# EasyEDA Pro project ULPLoRa.eprj

# Board ULPLoRa
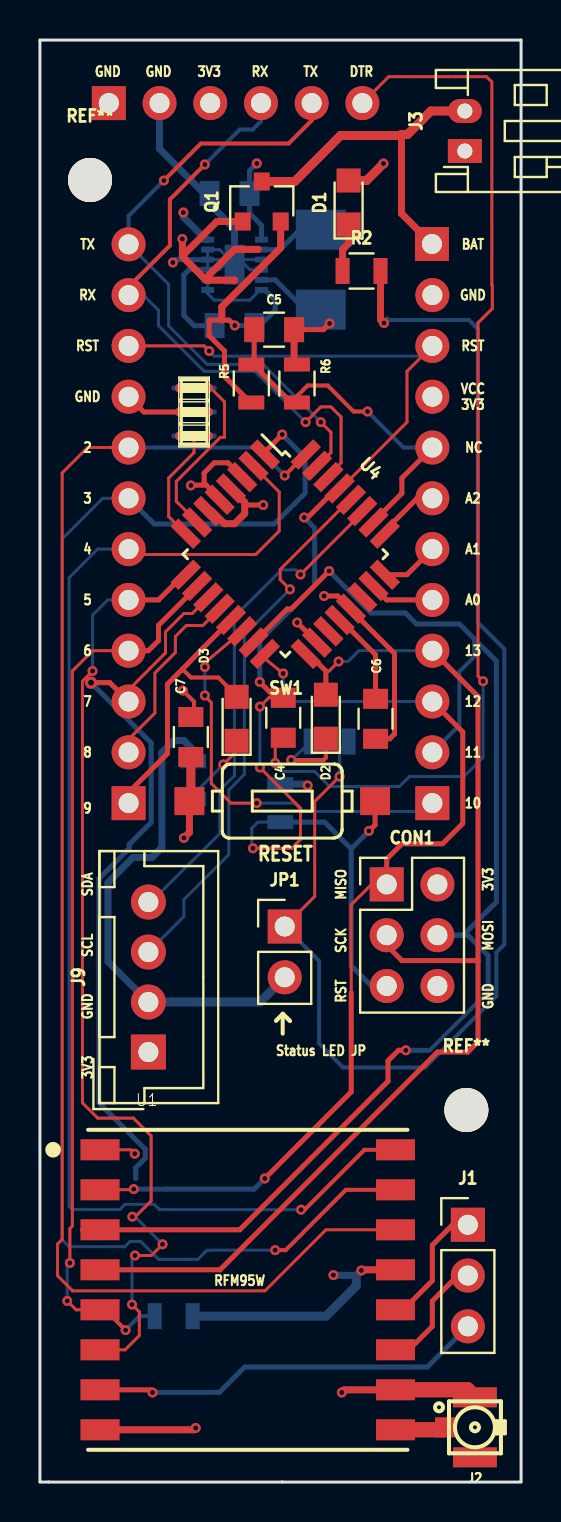
[diagram p0: board, top side]
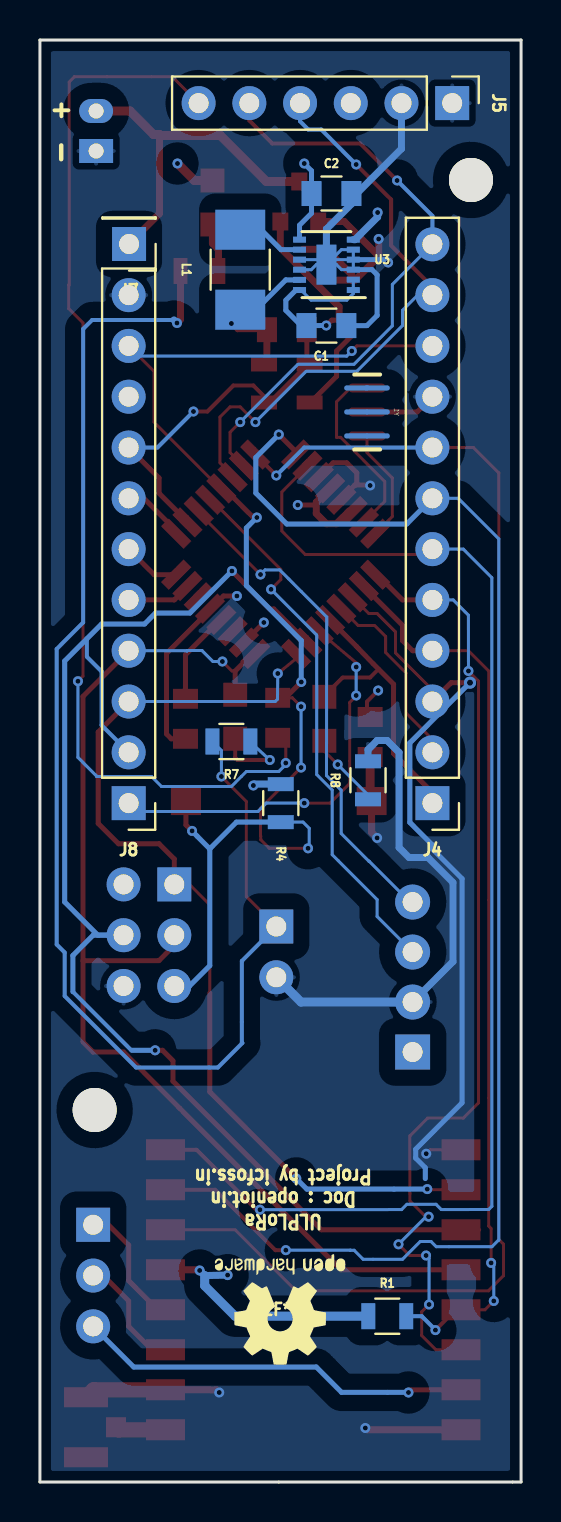
[diagram p1: board, bottom side, seen from below]

Outline 24.1 x 72.1 mm; copper layers: Top Layer, ground.plane, power.plane, Bottom Layer. Coordinates in mm from the lower left corner of the outline.
Outline path: 0,72.1 0,0 24.1,0 24.1,72.1 0,72.1
Stack: Top Layer 0.035mm / Dielectric1 0.48mm PP er 4.5 / ground.plane 0.035mm / Dielectric2 0.48mm FR4 er 4.5 / power.plane 0.035mm / Dielectric3 0.48mm PP er 4.5 / Bottom Layer 0.035mm

## Design rules (mm)
spacing safeClearance (default): track to track 0.152, other pairs 0.152 to 0.3
track width trackWidth (default): min 0.127, default 0.254, max 2.54
differential pair differentialPair (default): width min 0.127, default 0.254, max 2.54; gap min 0.152, default 0.152
via viaSize (default): diameter min 0.5, default 0.61, max 10; hole min 0.3, default 0.305, max 6
net GND uses CopperRegion2
net +3V3 uses CopperRegion1
pour ie1253 uses CopperRegion1
pour ie1254 uses CopperRegion
pour ie1255 uses CopperRegion2

## Placement (name value [footprint] x y rotation side)
C1  10uF  [Capacitors_SMD:C_0805]  9.75 57.82 180 bottom
C2  22uF  [Capacitors_SMD:C_0805]  9.5 64.42 180 bottom
C4  0.1uF  [Capacitors_SMD:C_0805]  12.19 38.21 270 top
C5  100nF  [Capacitors_SMD:C_0805]  11.73 57.62 0 top
C6  0.1uf  [Capacitors_SMD:C_0805]  16.81 38.16 270 top
C7  0.1uF  [Capacitors_SMD:C_0805]  7.56 37.25 270 top
CON1  AVR-ISP-6  [Pin_Headers:Pin_Header_Straight_2x03_Pitch2.54mm]  17.37 29.88 0 top
D1  RED  [LEDs:LED_0805]  15.46 63.97 90 top
D2  Green  [LEDs:LED_0805]  14.32 38.26 90 top
D3  Blue  [LEDs:LED_0805]  9.85 38.16 90 top
J1  DIO_BRK  [Pin_Headers:Pin_Header_Straight_1x03_Pitch2.54mm]  21.43 12.86 0 top
J2  Conn_Coaxial  [Footprints:U.FL-COAX]  21.79 2.73 0 top
J3  JST  [Connectors_JST:JST_PH_S2B-PH-K_02x2.00mm_Angled]  21.28 66.55 90 top
J4  LH_Connector  [Pin_Headers:Pin_Header_Straight_1x12_Pitch2.54mm]  4.44 33.94 0 bottom
J5  UART  [Pin_Headers:Pin_Header_Straight_1x06_Pitch2.54mm]  3.45 68.94 270 bottom
J7  VIN  [Pin_Headers:Pin_Header_Straight_1x01_Pitch2.54mm]  19.63 61.9 0 bottom
J8  RH_Connector  [Pin_Headers:Pin_Header_Straight_1x11_Pitch2.54mm]  19.66 33.94 0 bottom
J9  I2C  [Connectors_JST:JST_XH_B04B-XH-A_04x2.50mm_Straight]  5.43 21.5 90 top
JP1  JP  [Pin_Headers:Pin_Header_Straight_1x02_Pitch2.54mm]  12.26 27.77 0 top
L1  2.2uH  [Inductors_SMD:L_1210_HandSoldering]  14.07 60.61 90 bottom
Q1  DMG3415U-7  [TO_SOT_Packages_SMD:SOT-23]  11.11 64.02 90 top
R1  10K  [Resistors_SMD:R_0805]  6.7 8.29 180 bottom
R2  330  [Resistors_SMD:R_0805]  16.11 60.55 0 top
R4  10K  [Resistors_SMD:R_0805]  12.04 33.94 270 bottom
R5  680K  [Resistors_SMD:R_0805]  10.59 54.92 90 top
R6  680K  [Resistors_SMD:R_0805]  12.87 54.92 90 top
R7  330  [Resistors_SMD:R_0805]  14.51 37.02 0 bottom
R8  330  [Resistors_SMD:R_0805]  7.67 35.09 90 bottom
REF**  -  [Mounting_Holes:MountingHole_2.2mm_M2]  2.51 65.1 0 top
REF**#2  -  [Mounting_Holes:MountingHole_2.2mm_M2]  21.36 18.6 0 top
REF***  OSHW-Logo2_7.3x6mm_SilkScreen  [Symbols:OSHW-Logo2_7.3x6mm_SilkScreen]  12.07 8.62 0 bottom
SW1  RESET  [Footprints:3x6x2.5mm_tact_switch]  12.14 34.05 180 top
U1  RFM95W-868S2  [Footprints:XCVR_RFM95W-868S2]  10.41 9.61 0 top
U3  RP604K331A  [Footprints:DFN-12-1EP_2.7x3mm_Pitch0.5mm]  9.75 60.87 0 bottom
U4  ATMEGA328P-AU  [Housings_QFP:TQFP-32_7x7mm_Pitch0.8mm]  12.29 46.39 315 top
Y1  8Mhz  [Footprints:RESONATOR-SMD]  7.72 53.5 90 top

## Footprints (pads in the part's own frame, mm; a bottom-side part is the same pattern mirrored in y, then rotated)
Capacitors_SMD:C_0805
  rect 1x1.25 smd: 1(-1,0) 2(1,0)
Connectors_JST:JST_PH_S2B-PH-K_02x2.00mm_Angled
  rect 1.2x1.7 hole 0.75: 1(0,0)
  oval 1.2x1.7 hole 0.75: 2(2,0)
Connectors_JST:JST_XH_B04B-XH-A_04x2.50mm_Straight
  rect 1.75x1.75 hole 1: 1(0,0)
  round 1.75 hole 1: 2(2.5,0) 3(5,0) 4(7.5,0)
Footprints:3x6x2.5mm_tact_switch
  rect 1.5x1.4 smd: 1(-4.65,0) 2(4.65,0)
Footprints:DFN-12-1EP_2.7x3mm_Pitch0.5mm
  rect 0.65x0.3 smd: 1(-1.346,1.27) 2(-1.347,0.75) 3(-1.347,0.25) 4(-1.347,-0.25) 5(-1.347,-0.75) 6(-1.347,-1.25) 7(1.347,-1.25) 8(1.347,-0.75) 9(1.347,-0.25) 10(1.346,0.254) 11(1.346,0.762) 12(1.346,1.27)
  rect 1x2 smd: 13(0,0)
Footprints:RESONATOR-SMD
  oval 0.45x1.905 smd: 1(-1.199,0) 2(0,0) 3(1.199,0)
Footprints:U.FL-COAX
  rect 1x1 smd: 1(-1.5,0)
  rect 2.2x1 smd: 2(0,1.5) 3(0,-1.5)
Footprints:XCVR_RFM95W-868S2
  rect 1.95x1.05 smd: 1(-7.4,7) 2(-7.4,5) 3(-7.4,3) 4(-7.4,1) 5(-7.4,-1) 6(-7.4,-3) 7(-7.4,-5) 8(-7.4,-7) 9(7.4,-7) 10(7.4,-5) 11(7.4,-3) 12(7.4,-1) 13(7.4,1) 14(7.4,3) 15(7.4,5) 16(7.4,7)
Housings_QFP:TQFP-32_7x7mm_Pitch0.8mm
  rect 1.6x0.55 smd: 1(-4.25,2.8) 2(-4.25,2) 3(-4.25,1.2) 4(-4.25,0.4) 5(-4.25,-0.4) 6(-4.25,-1.2) 7(-4.25,-2) 8(-4.25,-2.8) 17(4.25,-2.8) 18(4.25,-2) 19(4.25,-1.2) 20(4.25,-0.4) 21(4.25,0.4) 22(4.25,1.2) 23(4.25,2) 24(4.25,2.8)
  rect 0.55x1.6 smd: 9(-2.8,-4.25) 10(-2,-4.25) 11(-1.2,-4.25) 12(-0.4,-4.25) 13(0.4,-4.25) 14(1.2,-4.25) 15(2,-4.25) 16(2.8,-4.25) 25(2.8,4.25) 26(2,4.25) 27(1.2,4.25) 28(0.4,4.25) 29(-0.4,4.25) 30(-1.2,4.25) 31(-2,4.25) 32(-2.8,4.25)
Inductors_SMD:L_1210_HandSoldering
  rect 2x2.5 smd: 1(-2,0) 2(2,0)
LEDs:LED_0805
  rect 1.2x1.2 smd: 1(-1.1,0) 2(1.1,0)
Mounting_Holes:MountingHole_2.2mm_M2
  round 2.2 hole 2.2: (0,0)
Pin_Headers:Pin_Header_Straight_1x01_Pitch2.54mm
  rect 1.7x1.7 hole 1: 1(0,0)
Pin_Headers:Pin_Header_Straight_1x02_Pitch2.54mm
  rect 1.7x1.7 hole 1: 1(0,0)
  round 1.7 hole 1: 2(0,-2.54)
Pin_Headers:Pin_Header_Straight_1x03_Pitch2.54mm
  rect 1.7x1.7 hole 1: 1(0,0)
  round 1.7 hole 1: 2(0,-2.54) 3(0,-5.08)
Pin_Headers:Pin_Header_Straight_1x06_Pitch2.54mm
  rect 1.7x1.7 hole 1: 1(0,0)
  round 1.7 hole 1: 2(0,-2.54) 3(0,-5.08) 4(0,-7.62) 5(0,-10.16) 6(0,-12.7)
Pin_Headers:Pin_Header_Straight_1x11_Pitch2.54mm
  rect 1.7x1.7 hole 1: 1(0,0)
  round 1.7 hole 1: 2(0,-2.54) 3(0,-5.08) 4(0,-7.62) 5(0,-10.16) 6(0,-12.7) 7(0,-15.24) 8(0,-17.78) 9(0,-20.32) 10(0,-22.86) 11(0,-25.4)
Pin_Headers:Pin_Header_Straight_1x12_Pitch2.54mm
  rect 1.7x1.7 hole 1: 1(0,0)
  round 1.7 hole 1: 2(0,-2.54) 3(0,-5.08) 4(0,-7.62) 5(0,-10.16) 6(0,-12.7) 7(0,-15.24) 8(0,-17.78) 9(0,-20.32) 10(0,-22.86) 11(0,-25.4) 12(0,-27.94)
Pin_Headers:Pin_Header_Straight_2x03_Pitch2.54mm
  rect 1.7x1.7 hole 1: 1(0,0)
  round 1.7 hole 1: 2(2.54,0) 3(0,-2.54) 4(2.54,-2.54) 5(0,-5.08) 6(2.54,-5.08)
Resistors_SMD:R_0805
  rect 0.7x1.3 smd: 1(-0.95,0) 2(0.95,0)
TO_SOT_Packages_SMD:SOT-23
  rect 0.9x0.8 smd: 1(-1,0.95) 2(-1,-0.95) 3(1,0)

## Nets
+3V3: C2.1 C7.1 CON1.2 D1.2 J5.3 J8.9 J9.1 R1.1 R4.1 U1.13 U3.6 U3.7 U4.4 U4.6 U4.18
/VIN: J3.2 J7.1 Q1.3
GND: C1.2 C2.2 C5.2 C6.2 C7.2 CON1.6 J2.2 J3.1 J4.9 J5.1 J5.2 J8.11 J9.2 JP1.2 Q1.1 R6.2 R8.2 SW1.2 U1.1 U1.8 U1.10 U3.3 U3.4 U3.5 U3.9 U3.10 U3.13 U4.3 U4.5 U4.21 Y1.2
/2: J4.8 U1.14 U4.32
/3: J4.7 U1.15 U4.1
/4: J4.6 U1.16 U4.2
/5: J4.5 U1.6 U4.9
/6: J4.4 R1.2 U1.5 U4.10
/7: J4.3 U4.11
/8: J4.2 U4.12
/9: D3.2 J4.1 U4.13
/10: J8.1 U4.14
/11: CON1.4 J8.2 U1.3 U4.15
/12: CON1.1 J8.3 U1.2 U4.16
/13: CON1.3 D2.2 J8.4 U1.4 U4.17
/A0: J8.5 U4.23
/A1: J8.6 U4.24
/A2: J8.7 U4.25
/A3: C5.1 J8.8 R5.2 R6.1 U4.26
/A4: J9.4 U4.27
/A5: J9.3 U4.28
/A6: U4.19
/A7: U4.22
/DTR: C4.2 J5.6
/RAW: C1.1 Q1.2 R5.1 U3.1 U3.2 U3.12
/RST: C4.1 CON1.5 J4.10 J8.10 R4.2 SW1.1 U4.29
/RXD: J4.11 J5.4 U4.30
/TXD: J4.12 J5.5 U4.31
NET-(C6-PAD1): C6.1 U4.20
NET-(D1-PAD1): D1.1 R2.1
NET-(D2-PAD1): D2.1 R7.1
NET-(D3-PAD1): D3.1 R8.1
NET-(J1-PAD1): J1.1 U1.12
NET-(J1-PAD2): J1.2 U1.11
NET-(J1-PAD3): J1.3 U1.7
NET-(J2-PAD1): J2.1 U1.9
NET-(JP1-PAD1): JP1.1 R2.2 R7.2
NET-(L1-PAD1): L1.1 U3.11
NET-(L1-PAD2): L1.2 U3.8
NET-(U4-PAD7): U4.7 Y1.3
NET-(U4-PAD8): U4.8 Y1.1

Pads without a net: J2 3

## Via types
v1: diameter 0.5, hole 0.25, Top Layer to Bottom Layer, 61 vias
v2: diameter 0.61, hole 0.305, Top Layer to Bottom Layer, 1 via

## Routing (per net, layer and track width the routed paths; a pad name or vN(x,y) marks a point on that pad's centre or on a via; arc(x,y) is an arc through that point)
+3V3: length 152.4
  Top Layer w0.15: 13.88,41.97 13.88,42.25
  Top Layer w0.2: 7.72,38.25 7.72,39.02 v1(7.16,39.57)
  Top Layer w0.25: U4.4 9.57,49.62 10.34,48.85 v1(11.19,48.85) ; v1(12.88,42.97) 13.88,41.98 13.88,41.97 13.88,42
  Top Layer w0.35: U4.4 10.26,48.99 10.26,48.42 9.75,47.91 9.24,47.91 8.61,48.55 U4.6 ; U1.13 16.13,10.61 v1(16.1,10.58)
  Top Layer w0.45: D1.2 16.36,65.07 v1(17.21,65.92)
  power.plane w0.2: 6.93,43.13 7.21,42.85 7.21,39.62 v1(7.16,39.57)
  power.plane w0.25: v1(11.19,48.85) 11.71,48.32 11.71,47.91 ; 12.26,41.31 12.26,42.35 v1(12.88,42.97)
  power.plane w0.35: v1(13.41,34.82) 14,34.24 14,33.84 ; 12,9.07 12,9.02 11.96,9.07 11.05,9.07 ; 18.13,54.26 J8.9 ; v1(7.19,63.47) 7.76,64.05 10.86,64.05 ; 9.89,15.76 5.43,20.22 J9.1 ; 8.53,68.94 8.53,68.65
  power.plane w0.45: J8.9 15.1,54.26 10.86,58.5 v1(10.86,65.92) 10.23,66.55 ; 17.36,33.19 16.53,34.02 14.19,34.02 12.58,32.42 12.54,32.42 9.24,29.12 9.24,25.31 J9.1 ; 17.36,33.19 17.36,36.92 12.97,41.31 11.81,41.31 ; 17.36,33.19 18.64,31.91 18.64,31.15 CON1.2 ; 11.81,41.31 12.26,41.31 ; 11.81,41.31 8.75,41.31 6.93,43.13 6.93,45.6 10.77,47.91 11.78,47.91 18.13,54.26 ; v1(17.21,65.92) 16.58,66.55 10.23,66.55 ; 10.23,66.55 8.53,68.25 8.53,68.94 ; v1(14.7,10.34) 14.44,10.34 13.93,9.83 13.93,9.82 13.17,9.07 11.05,9.07 9.89,10.23 9.89,15.76
  Bottom Layer w0.25: U3.7 11.1,62.84 10.5,63.44 C2.1 10.5,65.56 v1(10.86,65.92)
  Bottom Layer w0.35: R4.1 13.34,34.89 v1(13.41,34.82) ; v1(16.1,10.58) 15.85,10.32 v1(14.7,10.34) ; U3.6 8.32,62.12 7.19,63.25 v1(7.19,63.47)
  Bottom Layer w0.45: R1.1 14.32,8.29 15.85,9.81 15.85,10.32
/VIN: length 17.7
  Top Layer w0.35: 18.11,67.37 18.11,63.42 J7.1
  Top Layer w0.45: J3.2 19.58,68.55 18.41,67.37 18.11,67.37 18.06,67.32 15.06,67.32 12.76,65.02 Q1.3
GND: length 250.2
  Top Layer w0.15: v1(4.75,16.41) 4.55,16.61 U1.1
  Top Layer w0.25: 8.33,49.84 9,49.17 U4.5 ; 8.33,49.84 8.23,49.95 8.23,50.45 8.73,50.96 9.41,50.96 U4.3 ; 8.33,49.84 7.58,49.84 v1(7.56,49.82) ; Y1.2 5.2,53.5 J4.9 ; C5.2 14.2,57.62 v1(14.51,57.92) ; v1(14.23,44.3) 14.91,44.3 15.54,43.67 U4.21 15.58,43.61 17.76,41.42 17.76,37.4 17.52,37.16 C6.2 ; 7.72,34.28 SW1.2
  Top Layer w0.35: 9.75,60.11 9.73,60.09 8.48,60.09 ; v1(7.21,32.2) 7.49,32.48 SW1.2 ; U1.8 7.71,2.61 v1(7.8,2.7) ; U4.21 15.58,43.61 ; 8.48,60.09 8.32,60.09 7.13,61.27 7.13,61.3 ; 8.48,60.09 8.48,60.36 9.75,61.63 10.94,61.63 ; v1(15.12,4.47) 15.25,4.61 U1.10 16.99,4.61 ; Q1.1 8.86,63.02 7.13,61.3 ; 7.13,61.3 v1(7.13,62.15) ; R6.2 12.73,56.02 C5.2
  Top Layer w0.45: C7.2 7.56,34.12 SW1.2
  Top Layer w0.762: J2.2 21.41,4.61 U1.10
  ground.plane w0.25: v1(7.56,49.82) 6.11,48.37 6.11,48.25 ; v1(6.66,60.97) 6.7,60.93 ; v1(14.51,57.92) 14.66,58.07 ; 15.64,46.08 15.64,45.71 v1(14.23,44.3) ; 5.99,67.78 5.43,67.22 ; 7.46,24.04 7.42,24 J9.2
  ground.plane w0.35: v1(7.21,32.2) 6.96,32.2 6.96,29.63 7.46,29.12 7.46,23.53 7.42,23.53 7.42,23.82 ; v1(4.75,16.41) 5.43,16.42 ; 15.08,22.77 19.91,22.77 CON1.6 ; 15.08,22.77 8.48,22.77 7.42,23.82 ; 15.08,22.77 15.08,33.96 16.35,35.23 16.35,40.79 16.86,41.3 ; 15.11,4.48 v1(15.12,4.47) ; 7.42,24 7.42,23.82 ; v1(7.13,62.15) 6.66,61.67 v1(6.66,60.97) ; 12.15,4.1 12.15,4.09 ; 5.43,15.15 5.43,15.4 5.43,15.08
  ground.plane w0.45: 11.3,3.25 12.15,4.1 ; 11.3,3.25 11.3,9.21 5.43,15.08 ; 11.3,3.25 8.35,3.25 v1(7.8,2.7) ; 6.7,60.93 6.7,57.97 ; 6.7,57.97 6.7,56.52 J4.9 4.44,53.94 6.11,52.27 6.11,48.25 7.46,46.89 10.26,46.9 14.83,46.9 16.86,44.87 16.86,41.3 ; 6.7,57.97 6.7,58.33 8.48,60.11 12.29,60.11 13.05,59.34 14.66,59.34 ; 14.66,58.07 14.66,59.34 ; 14.66,59.34 J8.11 21.53,59.34 22.61,60.42 22.61,65.22 J3.1 ; 15.11,4.48 12.54,4.48 12.15,4.09 ; J5.2 5.99,67.78 5.18,66.96 4.16,66.96 3.45,67.67 J5.1 ; 5.43,16.42 5.43,15.15 ; 5.43,15.4 7.42,17.39 7.42,23.53
  Bottom Layer w0.15: U3.13 9.24,60.87 8.99,60.62 U3.3 U3.4 ; U3.13 9.5,61.12 U3.4 ; U3.13 10.26,60.87 10.51,60.61 U3.10 ; U3.13 9,61.62 U3.5 U3.4 ; U3.13 10,61.12 U3.9
  Bottom Layer w0.25: U3.3 7.47,60.62 7.21,60.36 7.21,58.33 7.72,57.82 C1.2 ; v1(6.66,60.97) 6.8,61.12 U3.4 ; C2.2 8.73,64.42
  Bottom Layer w0.35: J9.2 3.41,26.02 3.41,29.97 4.66,31.22 5.61,31.22 6.11,31.72 6.11,36.47 6.71,37.07 7.21,37.07 7.67,36.62 R8.2 ; U3.13 9.75,62.65 8.5,63.9 C2.2 8.23,64.42 5.99,66.66 J5.2
  Bottom Layer w0.45: JP1.2 11.02,24 J9.2
/2: length 72.6
  Top Layer w0.15: U1.14 14.32,12.61 11.27,9.56 1.62,9.56 1.62,9.57 0.88,10.31 0.88,11.89 1.11,12.13 1.11,50.45 2.38,51.72 J4.8 ; 13.21,51.37 U4.32
  Top Layer w0.2: U4.32 13.31,51.37 v1(12.26,50.32)
  Bottom Layer w0.2: J4.8 10.86,51.72 v1(12.26,50.32)
/3: length 73.3
  Top Layer w0.2: v1(11.78,11.59) 12.31,11.59 15.33,14.61 U1.15
  Top Layer w0.25: U4.1 11.26,51.5 v1(12.13,52.37)
  Bottom Layer w0.15: J4.7 3.15,49.18 1.11,47.15 1.11,12.1 1.12,12.1 1.46,11.76 4.25,11.76 4.51,12.02 5.05,12.02 5.94,11.13 7.91,11.13 8.36,11.58 8.55,11.58 8.55,11.59 v1(11.78,11.59)
  Bottom Layer w0.2: 4.83,49.5 J4.7
  Bottom Layer w0.25: v1(12.13,52.37) 13.28,51.22 13.28,49.45 11.73,47.9 5.73,47.9 J4.7
/4: length 64.8
  Top Layer w0.15: 10.7,50.81 10.7,50.79 11.98,49.5 11.98,47.55 10.81,46.37 4.71,46.37 J4.6
  Top Layer w0.2: U1.16 16.26,16.61 13.26,13.61 v1(13.08,13.61)
  Top Layer w0.25: 10.7,50.77 10.7,50.81
  Bottom Layer w0.15: v1(13.08,13.61) 5.98,13.62 5.72,13.88 4.26,13.88 4,13.62 3.83,13.62 1.62,13.62 1.46,13.78 1.46,45.22 2.89,46.64 J4.6
/5: length 49.4
  Top Layer w0.15: v1(4.63,13.26) 4.78,13.26 5.57,14.05 5.57,17.3 4.68,18.2 2.89,18.2 2.13,18.96 2.13,40.04 v1(2.63,40.55) ; v1(4.76,11.32) 5.58,11.32 v1(6.14,11.88) ; U1.6 4.27,6.61 4.98,7.32 4.98,8.5 v1(4.61,8.88)
  Top Layer w0.25: J4.5 5.94,44.1 7.2,45.36 7.3,45.36
  Bottom Layer w0.15: 3.91,44.1 J4.5 3.4,44.1 2.64,43.34 2.64,41.05 v1(2.63,40.55) ; v1(6.14,11.88) 4.76,13.26 v1(4.63,13.26) ; v1(4.61,8.88) 4.61,11.17 v1(4.76,11.32)
/6: length 45.4
  Top Layer w0.15: J4.4 2.64,41.56 1.62,40.55 1.62,12.8 1.5,12.67 v1(1.5,10.95) ; 3.08,8.61 U1.5 1.81,8.61 v1(1.37,9.05)
  Top Layer w0.2: v1(4.29,7.59) 3.27,8.61 U1.5
  Top Layer w0.25: J4.4 5.43,41.56 5.94,42.07 5.94,42.83 7.87,44.76 U4.10
  Bottom Layer w0.15: v1(1.37,9.05) 1.37,10.82 v1(1.5,10.95)
  Bottom Layer w0.2: R1.2 4.97,8.29 4.29,7.6 v1(4.29,7.59)
/7: length 37.8
  Top Layer w0.15: U4.11 7.63,43.42 7.21,43.42 6.29,42.5 6.29,41.45 4.44,39.61 J4.3
  Top Layer w0.25: U4.11 8.36,44.23
  Top Layer w0.254: v2(2.56,39.97) 3.5,39.97 J4.3
  Bottom Layer w0.254: 4.8,15.17 4.8,15.71 5.28,16.2 5.28,16.63 2.96,18.96 2.96,30.16 4.47,31.68 4.47,31.88 5.57,32.98 5.57,36.95 v2(2.56,39.97)
/8: length 9.6
  Top Layer w0.15: J4.2 4.44,37.13 5.76,38.45 5.76,40.45 6.78,41.47 6.78,42.27 7.33,42.82 8.16,42.82 U4.12
  Top Layer w0.25: U4.12 9,43.61
/9: length 14.6
  Top Layer w0.2: 7.14,40.64 7.56,40.22 8.94,40.22 9.85,39.31 D3.2
  Top Layer w0.25: U4.13 8.23,41.76 7.4,40.91 6.38,39.89 6.39,39.22 6.39,36.43 4.44,34.48 J4.1
/10: length 21.3
  Top Layer w0.15: v1(10.86,33.94) 9.57,33.94 8.58,34.92 8.58,38.97 8.26,39.3 v1(8.26,39.32) ; 10.06,42.54 U4.14 8.26,40.96 ; 8.26,40.96 v1(8.26,40.75) 8.26,40.96
  Top Layer w0.25: U4.14 10.21,42.54
  Bottom Layer w0.15: v1(10.86,33.94) 12.76,33.94 13.18,33.52 19.24,33.52 J8.1 19.15,33.94 ; 8.26,40.75 v1(8.26,39.32)
/11: length 69.4
  Top Layer w0.15: 10.66,41.97 10.7,41.97 10.7,42.26
  Top Layer w0.25: v1(18.33,21.58) 17.96,21.58 17.44,21.06 17.44,20.04 10.01,12.61 U1.3 2.13,12.61 ; 10.7,41.97 10.71,41.97 12.38,43.65 12.58,43.65 v1(14.48,45.55)
  Bottom Layer w0.15: 20.67,27.34 CON1.4
  Bottom Layer w0.2: 19.48,21.58 19.52,21.58 22.45,24.51 ; J8.2 21.01,37.84 21.01,40.52 21.75,41.26 21.75,42.16
  Bottom Layer w0.25: v1(18.33,21.58) 19.48,21.58 ; v1(14.48,45.55) 16.58,43.45 18.31,43.45 18.86,42.9 21.01,42.9 22.86,41.05 22.86,29 21.2,27.34 CON1.4 21.43,27.34 22.45,26.32 22.45,24.51
/12: length 48.9
  Top Layer w0.15: v1(12.19,40.42) 11.26,41.17 U4.16 ; 15.59,24.45 15.59,28.86 16.61,29.88 CON1.1 ; U1.2 4.67,14.62 v1(4.7,14.64)
  Top Layer w0.25: J8.3 21.18,37.5 21.18,32.93 20.16,31.91 18.13,31.91 17.37,31.15 CON1.1 ; 15.59,24.45 15.59,19.51 v1(11.26,15.17)
  Bottom Layer w0.15: v1(12.19,40.42) 12.2,39.14 12.32,39.02 J8.3
  Bottom Layer w0.25: v1(4.7,14.64) 6.36,14.64 10.73,14.64 v1(11.26,15.17)
/13: length 58.3
  Top Layer w0.15: 14.32,40.55 14.48,40.55 v1(14.96,41.02)
  Top Layer w0.25: 21.94,26.07 21.94,39.28 J8.4 ; 21.94,26.07 18.13,26.07 17.37,26.83 CON1.3 ; 21.94,26.07 21.94,22.01 21.43,21.5 19.91,21.5 9.02,10.61 U1.4 ; 13.21,41.4 U4.17 13.46,41.4 14.32,40.55 D2.2
  Bottom Layer w0.15: v1(14.96,41.02) 15.44,41.02 15.98,41.57 16.71,41.57 16.73,41.55 16.73,41.56 19.93,41.56
/A0: length 3.3
  Top Layer w0.25: U4.23 16.71,44.76 17.37,44.1 J8.5
/A1: length 2.9
  Top Layer w0.25: J8.6 18.38,45.36 17.27,45.36
/A2: length 3.3
  Top Layer w0.15: 17.27,47.42 17.38,47.42
  Top Layer w0.25: 17.27,47.42 17.27,47.56 18.89,49.18 J8.7
/A3: length 18.7
  Top Layer w0.15: U4.26 16.71,48.27
  Top Layer w0.2: R6.1 12.87,54.29 13.41,54.82 14.41,54.82 15.71,53.52 v1(16.41,53.52)
  Top Layer w0.25: R6.1 12.58,53.97 10.68,55.87 R5.2 10.73,56.02 C5.1 ; U4.26 16.71,48.02 18.13,49.44 18.13,50.2 J8.8
  Bottom Layer w0.2: J8.8 18.21,51.72 v1(16.41,53.52)
/A4: length 25.3
  Top Layer w0.15: 15.97,48.55 U4.27 ; 16.14,48.47 v1(13.05,45.37)
  Top Layer w0.25: U4.27 16.14,48.47
  Bottom Layer w0.15: v1(13.05,45.37) 12.82,45.6 12.09,45.6 9.73,43.25 9.75,35.32 9.01,34.59 9.01,32.42 7.61,31.02 7.61,31.04 5.57,29 J9.4
  Bottom Layer w0.25: 5.57,29 J9.4
/A5: length 27.4
  Top Layer w0.15: v1(12.52,44.63) 12.04,45.12 12.04,45.63 15.52,49.11
  Top Layer w0.25: U4.28 15.52,49.11
  Bottom Layer w0.15: v1(12.52,44.63) 10.24,42.35 10.24,35.37 9.46,34.6 9.46,31.37 7.21,29.12 7.21,28.28 J9.3
  Bottom Layer w0.25: J9.3 5.61,26.5
/DTR: length 54.3
  Top Layer w0.15: C4.2 11.78,36.81 v1(11.78,35.95) ; J5.6 17.47,70.27 22.37,70.27 22.63,70 22.63,59.85 22.66,59.85 22.66,58.67 21.94,57.96 21.94,40.29 v1(22.2,40.04)
  Bottom Layer w0.15: v1(11.78,35.95) 11.78,35.87 12.13,35.52 13.76,35.52 14.51,34.77 18.01,34.77 18.51,35.27 21.26,35.27 21.26,35.29 22.2,36.23 v1(22.2,40.04)
/RAW: length 20
  Top Layer w0.25: R5.1 10.55,53.97 9.24,55.28 9.24,56.55 8.48,57.31 8.48,58.09 9.48,58.09 v1(9.76,57.82)
  Top Layer w0.35: 9.11,58.09 9.11,58.76 12.06,61.71 Q1.2
  Bottom Layer w0.15: 8.4,60.12 U3.1 8.4,59.42 8.73,59.09 10.51,59.09 11.02,59.6 U3.12
  Bottom Layer w0.25: U3.12 11.27,59.6 11.78,59.09 11.78,58.58 11.02,57.82 C1.1 v1(9.76,57.82)
/RST: length 67.5
  Top Layer w0.15: J4.10 8.23,56.8 v1(8.48,56.55) ; v1(10.67,31.68) 12.61,31.68 13.04,32.11 13.04,32.29 13.05,32.29 13.05,33.69 v1(11.02,35.72) ; v1(11.02,38.77) 11.46,39.21 C4.1 12.19,39.38 ; J8.10 18.39,55.53 18.39,52.99 15.07,49.68 U4.29 15.01,49.62
  Top Layer w0.25: v1(16.48,32.55) 16.79,32.85 SW1.1 ; v1(13.23,48.22) 13.41,48.22 14.86,49.68 U4.29 ; v1(11.01,40) 11.8,39.21 C4.1
  Bottom Layer w0.15: v1(10.67,31.68) 10.7,31.66 10.61,31.74 10.61,32.68 10.92,32.99 R4.2 ; v1(11.02,38.77) v1(11.02,35.72) ; v1(8.48,56.55) 8.73,56.3 19.15,56.3 J8.10
  Bottom Layer w0.25: R4.2 14.26,32.99 15.59,31.66 ; v1(13.23,48.22) 13.76,47.7 13.76,44.82 11.01,42.07 v1(11.01,40) ; v1(16.48,32.55) 16.23,32.29 15.59,31.66 ; 15.59,31.66 15.59,25.82 16.61,24.8 CON1.5
/RXD: length 30.6
  Top Layer w0.15: U4.30 14.45,50.32 15.08,50.96 15.08,53.25 14.58,53.76 14.07,53.76 v1(13.31,52.99) ; J5.4 11.07,69.2
  Top Layer w0.2: J4.11 4.44,59.76 6.51,61.82 6.51,64.12 v1(8.26,65.87)
  Bottom Layer w0.15: v1(13.31,52.99) 10.77,55.53 8.23,55.53 5.94,57.82 5.94,58.58 5.18,59.34 J4.11 ; 11.07,68.79 J5.4
  Bottom Layer w0.2: J5.4 11.07,68.04 10.66,67.62 10.01,67.62 v1(8.26,65.87)
/TXD: length 30.7
  Top Layer w0.15: 13.88,50.81 13.92,50.81 14.58,51.47 14.58,52.49 v1(14.07,52.99)
  Top Layer w0.2: J5.5 13.61,68.08 12.46,66.92 8.06,66.92 v1(6.21,65.07)
  Bottom Layer w0.15: v1(14.07,52.99) 11.18,55.88 8.37,55.88 6.45,57.81 6.45,59.88 J4.12
  Bottom Layer w0.2: J4.12 4.44,63.31 v1(6.21,65.07)
NET-(C6-PAD1): length 4.8
  Top Layer w0.15: U4.20 15.07,43.1
  Top Layer w0.25: U4.20 15.07,43.1 16.81,41.36 C6.1
NET-(D1-PAD1): length 2.4
  Top Layer w0.35: R2.1 15.16,61.62 15.46,61.92 D1.1
NET-(D2-PAD1): length 4.3
  Top Layer w0.2: D2.1 14.32,36.21 14.21,36.1 v1(12.58,36.1)
  Bottom Layer w0.15: 13.63,37.25 13.63,37.06 v1(12.58,36.1)
NET-(D3-PAD1): length 4.3
  Top Layer w0.15: v1(9.19,35.87) 9.85,36.54 D3.1 9.85,36.84
  Bottom Layer w0.15: v1(9.19,35.87) 7.67,34.36 R8.1 7.91,34.14
NET-(J1-PAD1): length 6.4
  Top Layer w0.25: U1.12 18.2,8.61 19.66,10.07 19.66,11.85 20.67,12.86 J1.1
NET-(J1-PAD2): length 5.9
  Top Layer w0.25: U1.11 18.48,6.61 19.66,7.78 19.66,9.05 20.93,10.32 J1.2
NET-(J1-PAD3): length 19.8
  Top Layer w0.25: v1(5.64,4.47) 5.51,4.61 U1.7
  Bottom Layer w0.25: J1.3 19.4,5.75 10.26,5.75 8.99,4.48 5.64,4.48 v1(5.64,4.47)
NET-(J2-PAD1): length 2.5
  Top Layer w0.762: U1.9 20.17,2.61 J2.1
NET-(JP1-PAD1): length 69.7
  Top Layer w0.15: JP1.1 13.76,29.27 13.76,34.02 v1(15.01,35.27)
  Top Layer w0.35: R2.2 17.06,58.12 v1(17.23,57.95)
  Bottom Layer w0.15: v1(15.01,35.27) 15.01,36.57 R7.2
  Bottom Layer w0.2: JP1.1 13.98,26.05 13.98,21.97 13.96,21.95 15.19,20.72 19.28,20.72 22.86,24.3 22.86,26.47 23.26,26.87 23.26,41.65 21.94,42.97 21.94,57.65 21.48,58.1 17.38,58.1
  Bottom Layer w0.35: v1(17.23,57.95) 17.38,58.1
NET-(L1-PAD1): length 3.6
  Bottom Layer w0.25: U3.11 11.78,60.11 13.27,58.61 L1.1
NET-(L1-PAD2): length 3.4
  Bottom Layer w0.25: U3.8 12.02,61.62 13.02,62.61 L1.2
NET-(U4-PAD7): length 9.4
  Top Layer w0.15: Y1.3 8.55,54.7 9.24,54.01 9.24,52.23 9.04,52.23 6.83,50.02 6.83,49.03 7.87,47.99 U4.7
NET-(U4-PAD8): length 5.8
  Top Layer w0.15: Y1.1 7.72,51.47 6.45,50.2 6.45,48.27 7.3,47.42

## Copper pours and planes (outline as drawn; the poured copper is in the pictures)
+3V3 on power.plane: 24.33,71.64 24.32,-0.21 -0.2,-0.3 -0.22,72.32
GND on Bottom Layer: 24.31,72.3 24.31,-0.2 -0.19,-0.3 -0.22,72.31
GND on ground.plane: -0.23,72.32 24.32,72.32 24.32,-0.2 -0.2,-0.3

## Text on the board
Bottom Silkscreen Layer: ULPLoRa / Doc : openiot.in / Project by icfoss.in | + | -
Top Silkscreen Layer: TX | RX | RST | GND | 2 | 3 | 4 | 5 | 6 | 7 | 8 | 9 | 3V3 | RFM95W | Status LED JP | DTR | BAT | VCC / 3V3 | A2 | A1 | A0 | 13 | 12 | 11 | 10 | NC | SDA | SCL | MISO | SCK | MOSI | RESET
